# Altium schematic sheet mpc57_mcupower.SchDoc: MCU Power
size Letter; Organization: NewAE Technology Inc.; Address1: 1083 Queen St., Suite 196; Address2: Halifax; Address3: NS; Address4: Canada B3H 0B2; SheetApproved: YES
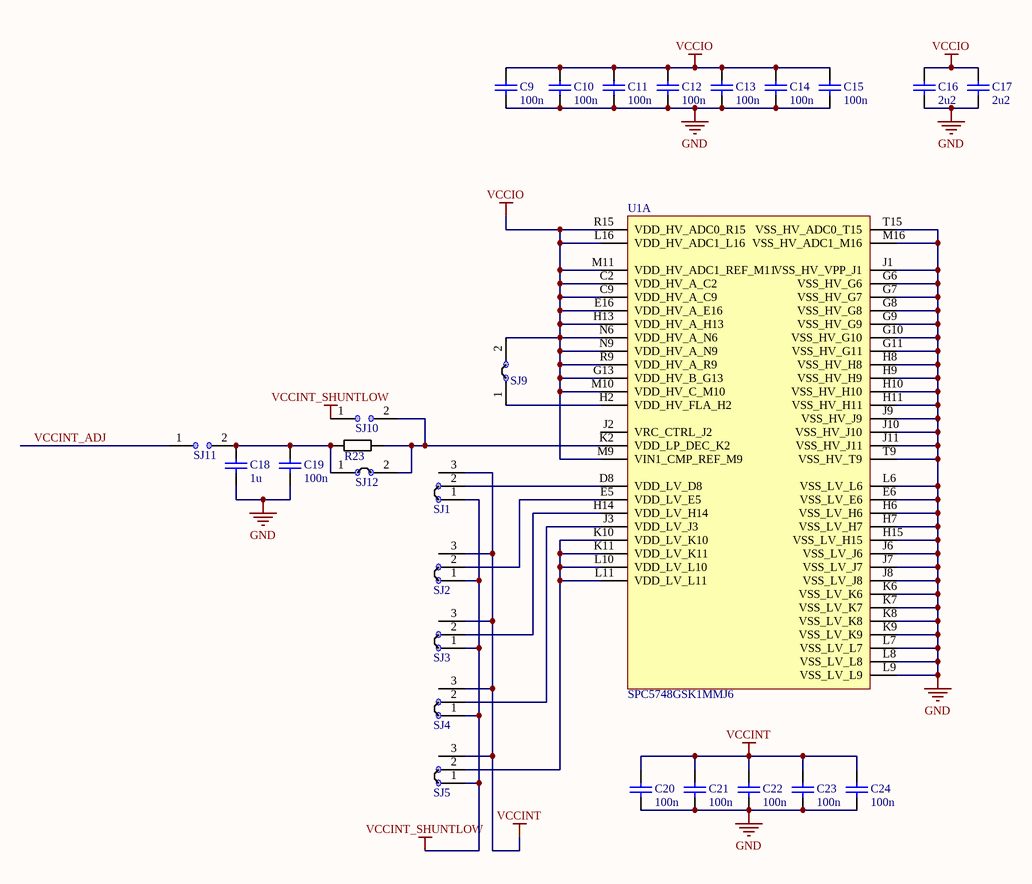
[diagram p0: mpc57_mcupower.SchDoc]

## Parts
C9  100n  [CAPC0402_M]
C10  100n  [CAPC0402_M]
C11  100n  [CAPC0402_M]
C12  100n  [CAPC0402_M]
C13  100n  [CAPC0402_M]
C14  100n  [CAPC0402_M]
C15  100n  [CAPC0402_M]
C16  2u2  [CAPC0603_M]
C17  2u2  [CAPC0603_M]
C18  1u  [CAPC0603_M]
C19  100n  [CAPC0402_M]
C20  100n  [CAPC0402_M]
C21  100n  [CAPC0402_M]
C22  100n  [CAPC0402_M]
C23  100n  [CAPC0402_M]
C24  100n  [CAPC0402_M]
R23  1R0  [RESC1608X55N]  (value not drawn)
SJ1  NC  [SJ_3S_NC12]  (value not drawn)  (no BOM)
SJ2  NC  [SJ_3S_NC12]  (value not drawn)  (no BOM)
SJ3  NC  [SJ_3S_NC12]  (value not drawn)  (no BOM)
SJ4  NC  [SJ_3S_NC12]  (value not drawn)  (no BOM)
SJ5  NC  [SJ_3S_NC12]  (value not drawn)  (no BOM)
SJ9  NC  [SJ_2S_NC]  (value not drawn)  (no BOM)
SJ10  NO  [SJ_2S_NO]  (value not drawn)  (no BOM)
SJ11  NO  [SJ_2S_NO]  (value not drawn)  (no BOM)
SJ12  NC  [SJ_2S_NC]  (value not drawn)  (no BOM)
U1  SPC5748GSK1MMJ6  [BGA256C100P16X16_1700X1700X170]  (part A of 5)

## Nets
GND: C9.2 C10.2 C11.2 C12.2 C13.2 C14.2 C15.2 C16.2 C17.2 C18.2 C19.2 C20.2 C21.2 C22.2 C23.2 C24.2 U1.E6(VSS_LV_E6) U1.G6(VSS_HV_G6) U1.G7(VSS_HV_G7) U1.G8(VSS_HV_G8) U1.G9(VSS_HV_G9) U1.G10(VSS_HV_G10) U1.G11(VSS_HV_G11) U1.H6(VSS_LV_H6) U1.H7(VSS_LV_H7) U1.H8(VSS_HV_H8) U1.H9(VSS_HV_H9) U1.H10(VSS_HV_H10) U1.H11(VSS_HV_H11) U1.H15(VSS_LV_H15) U1.J1(VSS_HV_VPP_J1) U1.J6(VSS_LV_J6) U1.J7(VSS_LV_J7) U1.J8(VSS_LV_J8) U1.J9(VSS_HV_J9) U1.J10(VSS_HV_J10) U1.J11(VSS_HV_J11) U1.K6(VSS_LV_K6) U1.K7(VSS_LV_K7) U1.K8(VSS_LV_K8) U1.K9(VSS_LV_K9) U1.L6(VSS_LV_L6) U1.L7(VSS_LV_L7) U1.L8(VSS_LV_L8) U1.L9(VSS_LV_L9) U1.M16(VSS_HV_ADC1_M16) U1.T9(VSS_HV_T9) U1.T15(VSS_HV_ADC0_T15)
VCCINT: C20.1 C21.1 C22.1 C23.1 C24.1 SJ1.3 SJ2.3 SJ3.3 SJ4.3 SJ5.3
VCCINT_SHUNTLOW: SJ1.1 SJ2.1 SJ3.1 SJ4.1 SJ5.1 SJ10.1
VCCIO: C9.1 C10.1 C11.1 C12.1 C13.1 C14.1 C15.1 C16.1 C17.1 SJ9.2 U1.C2(VDD_HV_A_C2) U1.C9(VDD_HV_A_C9) U1.E16(VDD_HV_A_E16) U1.G13(VDD_HV_B_G13) U1.H13(VDD_HV_A_H13) U1.L16(VDD_HV_ADC1_L16) U1.M9(VIN1_CMP_REF_M9) U1.M10(VDD_HV_C_M10) U1.M11(VDD_HV_ADC1_REF_M11) U1.N6(VDD_HV_A_N6) U1.N9(VDD_HV_A_N9) U1.R9(VDD_HV_A_R9) U1.R15(VDD_HV_ADC0_R15)
VCCINT_ADJ: SJ11.1
NetC18_1: C18.1 C19.1 R23.1 SJ11.2 SJ12.1
NetR23_2: R23.2 SJ10.2 SJ12.2 U1.K2(VDD_LP_DEC_K2)
NetSJ1_2: SJ1.2 U1.D8(VDD_LV_D8)
NetSJ2_2: SJ2.2 U1.E5(VDD_LV_E5)
NetSJ3_2: SJ3.2 U1.H14(VDD_LV_H14)
NetSJ4_2: SJ4.2 U1.J3(VDD_LV_J3)
NetSJ5_2: SJ5.2 U1.K10(VDD_LV_K10) U1.K11(VDD_LV_K11) U1.L10(VDD_LV_L10) U1.L11(VDD_LV_L11)
NetSJ9_1: SJ9.1 U1.H2(VDD_HV_FLA_H2)

Not connected (* = marked no-connect by the designer): U1 J2(VRC_CTRL_J2)

## Notes on the sheet
- Title:
- Date:
- Rev:
- Time:
- Project:
- Sheet
- of
- License:
- Copyright © NewAE Technology Inc.
- Approved:
- NewAE.com
- File:

## Library data of the parts
C9-C15 C19-C24 = CCHIP-100n-0402: 100n, 0402; Case-EIA: 0402; Part Number: CCHIP-100n-0402; Component Kind: Standard; Component Type: Standard; Footprint: 0402; Pin Count: 2; Value: 100n; Mounting Technology: SMT
C16 C17 = CCHIP-2u2-0603: 2u2, 0603; Case-EIA: 0603; Case-Metric: 1608; Part Number: CCHIP-2u2-0603; Component Kind: Standard; Component Type: Standard; Footprint: 0603; Pin Count: 2; Value: 2u2; Mounting Technology: SMT
C18 = CCHIP-1u-0603: 1u, 0603; Case-EIA: 0603; Case-Metric: 1608; Part Number: CCHIP-1u-0603; Component Kind: Standard; Component Type: Standard; Footprint: 0603; Pin Count: 2; Value: 1u; Mounting Technology: SMT
R23 = RCHIP-1R0-0603: 1R0 res, 0603, 1%, 1/10W; Manufacture 1: Yageo; Manufacture Part Number 1: RC0603FR-071RL; Case-EIA: 0603; Case-Metric: 1608; Rated Power: 0.1W; Rated Voltage: 75VDC; Part Number: RCHIP-1R0-0603; Component Kind: Standard; Component Type: Standard; Footprint: 0603; Pin Count: 2; Supplier 1: Digi-Key; Supplier Part Number 1: 311-1.00HRCT-ND; Value: 1R0; Tolerance: 1%; Mounting Technology: SMT; Temperature Range: -55C to 155C
SJ1-SJ5 = SJ_3S_12JMP: Solder Jumper, NC; Part Number: SJ_3S_12JMP; Component Type: Standard (No BOM); Pin Count: 3
SJ9 SJ12 = SJ_2S: Solder Jumper, NC; Part Number: SJ_2S; Component Type: Standard (No BOM); Pin Count: 2
SJ10 SJ11 = SJ_2S_NO: Solder Jumper, NO; Part Number: SJ_2S_NO; Component Type: Standard (No BOM); Pin Count: 2; Mounting Technology: COPPER
U1 = SPC5748GSK1MMJ6: Freescale 32-bit MCU, Triple core, 6MB Flash, 160MHz, -40/+125degC, Automotive Qualified, BGA 256